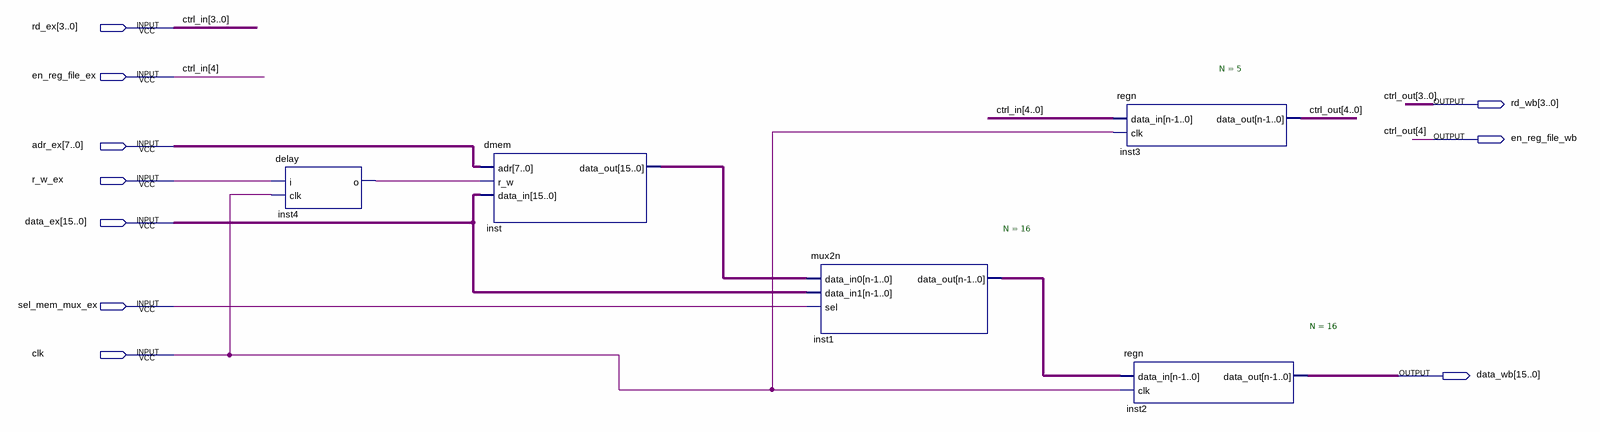
[diagram p0: schematic sheet]
// Quartus schematic memstage.bdf as structural Verilog: 5 symbols, 10 pins
module memstage (
  input  [3:0] rd_ex,
  input  en_reg_file_ex,
  input  [7:0] adr_ex,
  input  r_w_ex,
  input  [15:0] data_ex,
  input  sel_mem_mux_ex,
  input  clk,
  output [3:0] rd_wb,
  output en_reg_file_wb,
  output [15:0] data_wb
);

  wire inst4_o;
  wire [15:0] inst1_data_out, inst_data_out;

  delay inst4 (.i(r_w_ex), .clk(clk), .o(inst4_o));
  dmem inst (.adr(adr_ex), .r_w(inst4_o), .data_in(data_ex), .data_out(inst_data_out));
  mux2n #(.N(16)) inst1 (.data_in0(inst_data_out), .data_in1(data_ex), .sel(sel_mem_mux_ex), .data_out(inst1_data_out));
  regn #(.N(5)) inst3 (.data_in({en_reg_file_ex, rd_ex}), .clk(clk), .data_out({en_reg_file_wb, rd_wb}));
  regn #(.N(16)) inst2 (.data_in(inst1_data_out), .clk(clk), .data_out(data_wb));

  // Other names for the same wires on the sheet: ctrl_in[4:0] = {en_reg_file_ex, rd_ex};
  //   ctrl_out[4:0] = {en_reg_file_wb, rd_wb}
endmodule
